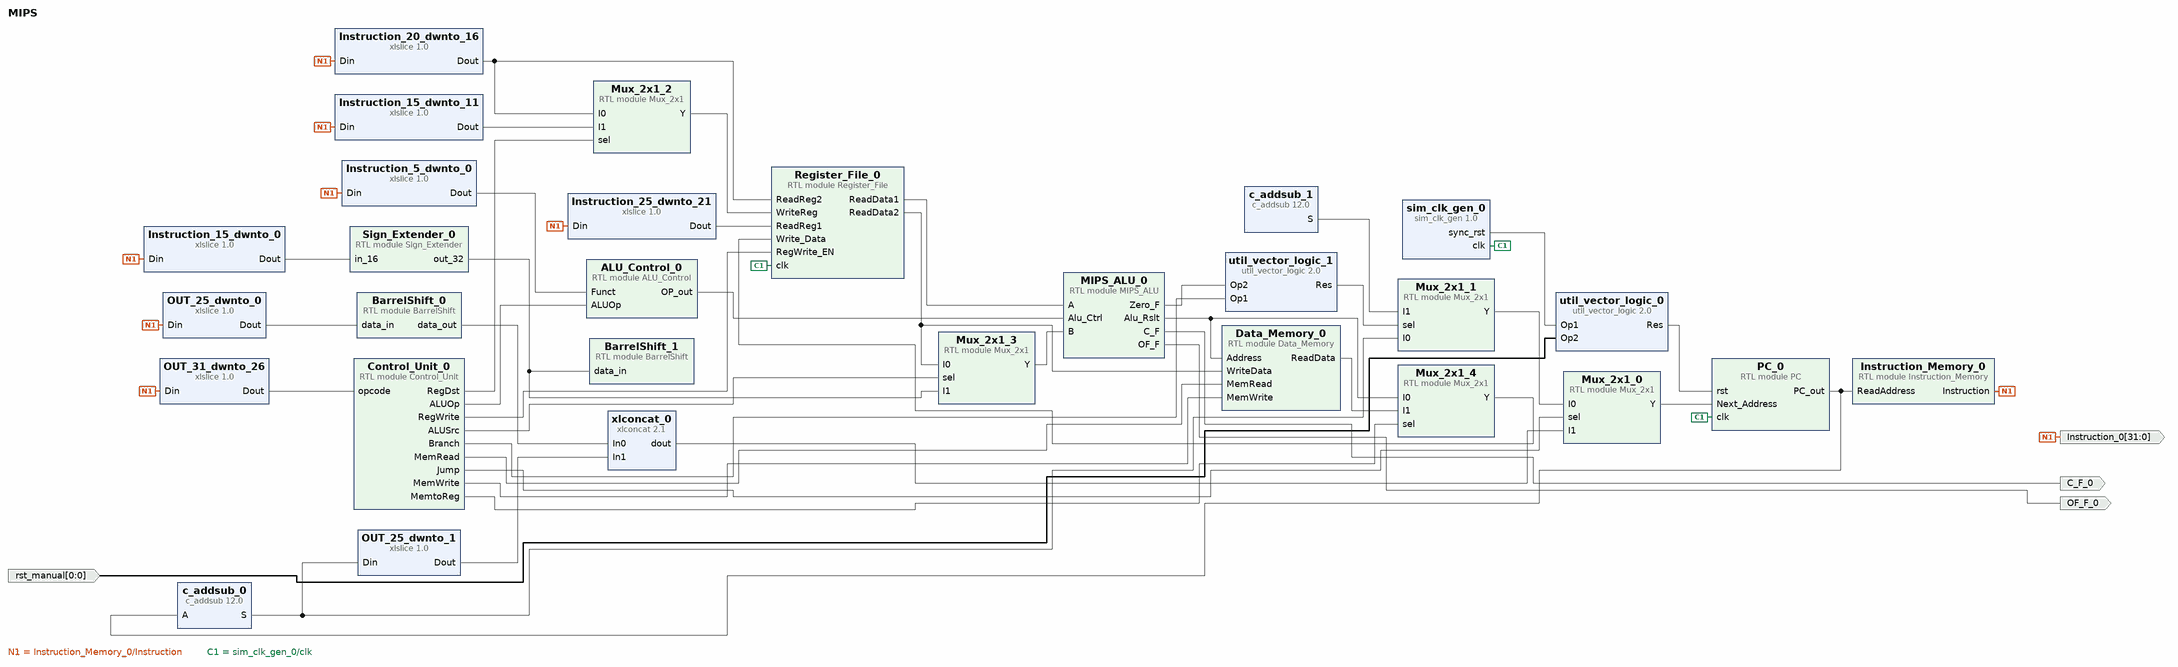
[diagram p0: block diagram of the top level]
# Vivado block design MIPS, xc7k70tfbv676-1, Vivado 2024.1
create_bd_design MIPS

create_bd_port -dir O C_F_0
create_bd_port -dir O -from 31 -to 0 Instruction_0
create_bd_port -dir O OF_F_0
create_bd_port -dir I -from 0 -to 0 rst_manual

create_bd_cell -type module -reference ALU_Control ALU_Control_0
create_bd_cell -type module -reference BarrelShift BarrelShift_0
set_property -dict {CONFIG.N 26 CONFIG.OUT_WIDTH 28 CONFIG.W 2} [get_bd_cells BarrelShift_0]
create_bd_cell -type module -reference BarrelShift BarrelShift_1
set_property -dict {CONFIG.N 32 CONFIG.OUT_WIDTH 32 CONFIG.W 2} [get_bd_cells BarrelShift_1]
create_bd_cell -type module -reference Control_Unit Control_Unit_0
create_bd_cell -type module -reference Data_Memory Data_Memory_0
create_bd_cell -type ip -vlnv xilinx.com:ip:xlslice:1.0 Instruction_15_dwnto_0
set_property -dict {CONFIG.DIN_FROM 15 CONFIG.DIN_TO 0} [get_bd_cells Instruction_15_dwnto_0]
create_bd_cell -type ip -vlnv xilinx.com:ip:xlslice:1.0 Instruction_15_dwnto_11
set_property -dict {CONFIG.DIN_FROM 15 CONFIG.DIN_TO 11} [get_bd_cells Instruction_15_dwnto_11]
create_bd_cell -type ip -vlnv xilinx.com:ip:xlslice:1.0 Instruction_20_dwnto_16
set_property -dict {CONFIG.DIN_FROM 20 CONFIG.DIN_TO 16} [get_bd_cells Instruction_20_dwnto_16]
create_bd_cell -type ip -vlnv xilinx.com:ip:xlslice:1.0 Instruction_25_dwnto_21
set_property -dict {CONFIG.DIN_FROM 25 CONFIG.DIN_TO 21} [get_bd_cells Instruction_25_dwnto_21]
create_bd_cell -type ip -vlnv xilinx.com:ip:xlslice:1.0 Instruction_5_dwnto_0
set_property -dict {CONFIG.DIN_FROM 5 CONFIG.DIN_TO 0} [get_bd_cells Instruction_5_dwnto_0]
create_bd_cell -type module -reference Instruction_Memory Instruction_Memory_0
create_bd_cell -type module -reference MIPS_ALU MIPS_ALU_0
create_bd_cell -type module -reference Mux_2x1 Mux_2x1_0
set_property -dict {CONFIG.N 32} [get_bd_cells Mux_2x1_0]
create_bd_cell -type module -reference Mux_2x1 Mux_2x1_1
set_property -dict {CONFIG.N 32} [get_bd_cells Mux_2x1_1]
create_bd_cell -type module -reference Mux_2x1 Mux_2x1_2
set_property -dict {CONFIG.N 5} [get_bd_cells Mux_2x1_2]
create_bd_cell -type module -reference Mux_2x1 Mux_2x1_3
set_property -dict {CONFIG.N 32} [get_bd_cells Mux_2x1_3]
create_bd_cell -type module -reference Mux_2x1 Mux_2x1_4
set_property -dict {CONFIG.N 32} [get_bd_cells Mux_2x1_4]
create_bd_cell -type ip -vlnv xilinx.com:ip:xlslice:1.0 OUT_25_dwnto_0
set_property -dict {CONFIG.DIN_FROM 25 CONFIG.DIN_TO 0} [get_bd_cells OUT_25_dwnto_0]
create_bd_cell -type ip -vlnv xilinx.com:ip:xlslice:1.0 OUT_25_dwnto_1
set_property -dict {CONFIG.DIN_FROM 31 CONFIG.DIN_TO 28} [get_bd_cells OUT_25_dwnto_1]
create_bd_cell -type ip -vlnv xilinx.com:ip:xlslice:1.0 OUT_31_dwnto_26
set_property -dict {CONFIG.DIN_FROM 31 CONFIG.DIN_TO 26} [get_bd_cells OUT_31_dwnto_26]
create_bd_cell -type module -reference PC PC_0
create_bd_cell -type module -reference Register_File Register_File_0
create_bd_cell -type module -reference Sign_Extender Sign_Extender_0
create_bd_cell -type ip -vlnv xilinx.com:ip:c_addsub:12.0 c_addsub_0
set_property -dict [list \
  CONFIG.A_Type Unsigned \
  CONFIG.A_Width 32 \
  CONFIG.B_Constant true \
  CONFIG.B_Type Unsigned \
  CONFIG.B_Value 0100 \
  CONFIG.B_Width 4 \
  CONFIG.Bypass false \
  CONFIG.CE false \
  CONFIG.Latency 0 \
  CONFIG.Out_Width 32 \
  CONFIG.SSET false \
] [get_bd_cells c_addsub_0]
create_bd_cell -type ip -vlnv xilinx.com:ip:c_addsub:12.0 c_addsub_1
set_property -dict [list \
  CONFIG.A_Type Unsigned \
  CONFIG.A_Width 32 \
  CONFIG.B_Constant false \
  CONFIG.B_Type Signed \
  CONFIG.B_Value 00000000000000000000000000000000 \
  CONFIG.B_Width 32 \
  CONFIG.Bypass false \
  CONFIG.CE false \
  CONFIG.Latency 0 \
  CONFIG.Out_Width 32 \
  CONFIG.SSET false \
] [get_bd_cells c_addsub_1]
create_bd_cell -type ip -vlnv xilinx.com:ip:sim_clk_gen:1.0 sim_clk_gen_0
set_property -dict [list \
  CONFIG.FREQ_HZ 20000000 \
  CONFIG.INITIAL_RESET_CLOCK_CYCLES 2 \
  CONFIG.RESET_POLARITY ACTIVE_HIGH \
] [get_bd_cells sim_clk_gen_0]
create_bd_cell -type ip -vlnv xilinx.com:ip:util_vector_logic:2.0 util_vector_logic_0
set_property -dict {CONFIG.C_OPERATION or CONFIG.C_SIZE 1} [get_bd_cells util_vector_logic_0]
create_bd_cell -type ip -vlnv xilinx.com:ip:util_vector_logic:2.0 util_vector_logic_1
set_property -dict {CONFIG.C_OPERATION and CONFIG.C_SIZE 1} [get_bd_cells util_vector_logic_1]
create_bd_cell -type ip -vlnv xilinx.com:ip:xlconcat:2.1 xlconcat_0

# ---- connections ----

connect_bd_net [get_bd_pins ALU_Control_0/OP_out] [get_bd_pins MIPS_ALU_0/Alu_Ctrl]
connect_bd_net [get_bd_pins BarrelShift_0/data_out] [get_bd_pins xlconcat_0/In0]
connect_bd_net [get_bd_pins Control_Unit_0/ALUOp] [get_bd_pins ALU_Control_0/ALUOp]
connect_bd_net [get_bd_pins Control_Unit_0/ALUSrc] [get_bd_pins Mux_2x1_3/sel]
connect_bd_net [get_bd_pins Control_Unit_0/Branch] [get_bd_pins util_vector_logic_1/Op1]
connect_bd_net [get_bd_pins Control_Unit_0/Jump] [get_bd_pins Mux_2x1_0/sel]
connect_bd_net [get_bd_pins Control_Unit_0/MemRead] [get_bd_pins Data_Memory_0/MemRead]
connect_bd_net [get_bd_pins Control_Unit_0/MemWrite] [get_bd_pins Data_Memory_0/MemWrite]
connect_bd_net [get_bd_pins Control_Unit_0/MemtoReg] [get_bd_pins Mux_2x1_4/sel]
connect_bd_net [get_bd_pins Control_Unit_0/RegDst] [get_bd_pins Mux_2x1_2/sel]
connect_bd_net [get_bd_pins Control_Unit_0/RegWrite] [get_bd_pins Register_File_0/RegWrite_EN]
connect_bd_net [get_bd_pins Data_Memory_0/ReadData] [get_bd_pins Mux_2x1_4/I1]
connect_bd_net [get_bd_pins Instruction_15_dwnto_0/Dout] [get_bd_pins Sign_Extender_0/in_16]
connect_bd_net [get_bd_pins Instruction_15_dwnto_11/Dout] [get_bd_pins Mux_2x1_2/I1]
connect_bd_net [get_bd_pins Instruction_20_dwnto_16/Dout] [get_bd_pins Mux_2x1_2/I0] [get_bd_pins Register_File_0/ReadReg2]
connect_bd_net [get_bd_pins Instruction_25_dwnto_21/Dout] [get_bd_pins Register_File_0/ReadReg1]
connect_bd_net [get_bd_pins Instruction_5_dwnto_0/Dout] [get_bd_pins ALU_Control_0/Funct]
connect_bd_net [get_bd_pins Instruction_Memory_0/Instruction] \
  [get_bd_ports Instruction_0] [get_bd_pins Instruction_25_dwnto_21/Din] [get_bd_pins Instruction_20_dwnto_16/Din] \
  [get_bd_pins Instruction_15_dwnto_11/Din] [get_bd_pins OUT_31_dwnto_26/Din] [get_bd_pins Instruction_15_dwnto_0/Din] \
  [get_bd_pins Instruction_5_dwnto_0/Din] [get_bd_pins OUT_25_dwnto_0/Din]
connect_bd_net [get_bd_pins MIPS_ALU_0/Alu_Rslt] [get_bd_pins Data_Memory_0/Address] [get_bd_pins Mux_2x1_4/I0]
connect_bd_net [get_bd_pins MIPS_ALU_0/C_F] [get_bd_ports C_F_0]
connect_bd_net [get_bd_pins MIPS_ALU_0/OF_F] [get_bd_ports OF_F_0]
connect_bd_net [get_bd_pins MIPS_ALU_0/Zero_F] [get_bd_pins util_vector_logic_1/Op2]
connect_bd_net [get_bd_pins Mux_2x1_0/Y] [get_bd_pins PC_0/Next_Address]
connect_bd_net [get_bd_pins Mux_2x1_1/Y] [get_bd_pins Mux_2x1_0/I0]
connect_bd_net [get_bd_pins Mux_2x1_2/Y] [get_bd_pins Register_File_0/WriteReg]
connect_bd_net [get_bd_pins Mux_2x1_3/Y] [get_bd_pins MIPS_ALU_0/B]
connect_bd_net [get_bd_pins Mux_2x1_4/Y] [get_bd_pins Register_File_0/Write_Data]
connect_bd_net [get_bd_pins OUT_25_dwnto_0/Dout] [get_bd_pins BarrelShift_0/data_in]
connect_bd_net [get_bd_pins OUT_25_dwnto_1/Dout] [get_bd_pins xlconcat_0/In1]
connect_bd_net [get_bd_pins OUT_31_dwnto_26/Dout] [get_bd_pins Control_Unit_0/opcode]
connect_bd_net -net Op2_0_1 [get_bd_ports rst_manual] [get_bd_pins util_vector_logic_0/Op2]
connect_bd_net [get_bd_pins PC_0/PC_out] [get_bd_pins c_addsub_0/A] [get_bd_pins Instruction_Memory_0/ReadAddress]
connect_bd_net [get_bd_pins Register_File_0/ReadData1] [get_bd_pins MIPS_ALU_0/A]
connect_bd_net [get_bd_pins Register_File_0/ReadData2] [get_bd_pins Mux_2x1_3/I0] [get_bd_pins Data_Memory_0/WriteData]
connect_bd_net [get_bd_pins Sign_Extender_0/out_32] [get_bd_pins BarrelShift_1/data_in] [get_bd_pins Mux_2x1_3/I1]
connect_bd_net [get_bd_pins c_addsub_0/S] [get_bd_pins OUT_25_dwnto_1/Din] [get_bd_pins Mux_2x1_1/I0]
connect_bd_net [get_bd_pins c_addsub_1/S] [get_bd_pins Mux_2x1_1/I1]
connect_bd_net [get_bd_pins sim_clk_gen_0/clk] [get_bd_pins PC_0/clk] [get_bd_pins Register_File_0/clk]
connect_bd_net [get_bd_pins sim_clk_gen_0/sync_rst] [get_bd_pins util_vector_logic_0/Op1]
connect_bd_net [get_bd_pins util_vector_logic_0/Res] [get_bd_pins PC_0/rst]
connect_bd_net [get_bd_pins util_vector_logic_1/Res] [get_bd_pins Mux_2x1_1/sel]
connect_bd_net [get_bd_pins xlconcat_0/dout] [get_bd_pins Mux_2x1_0/I1]

set_property USER_COMMENTS.comment_0 PC+4+BranchAddr [current_bd_design]
set_property USER_COMMENTS.comment_1 PC+4 [current_bd_design]
set_property USER_COMMENTS.comment_2 PC+4+BranchAddr [current_bd_design]
set_property USER_COMMENTS.comment_3 PC+4 [current_bd_design]

validate_bd_design
save_bd_design
